# Altium schematic sheet 07. MT7688AN RF Front End.SchDoc
size A3; DocumentNumber: 7; SheetNumber: 7; SheetTotal: 12
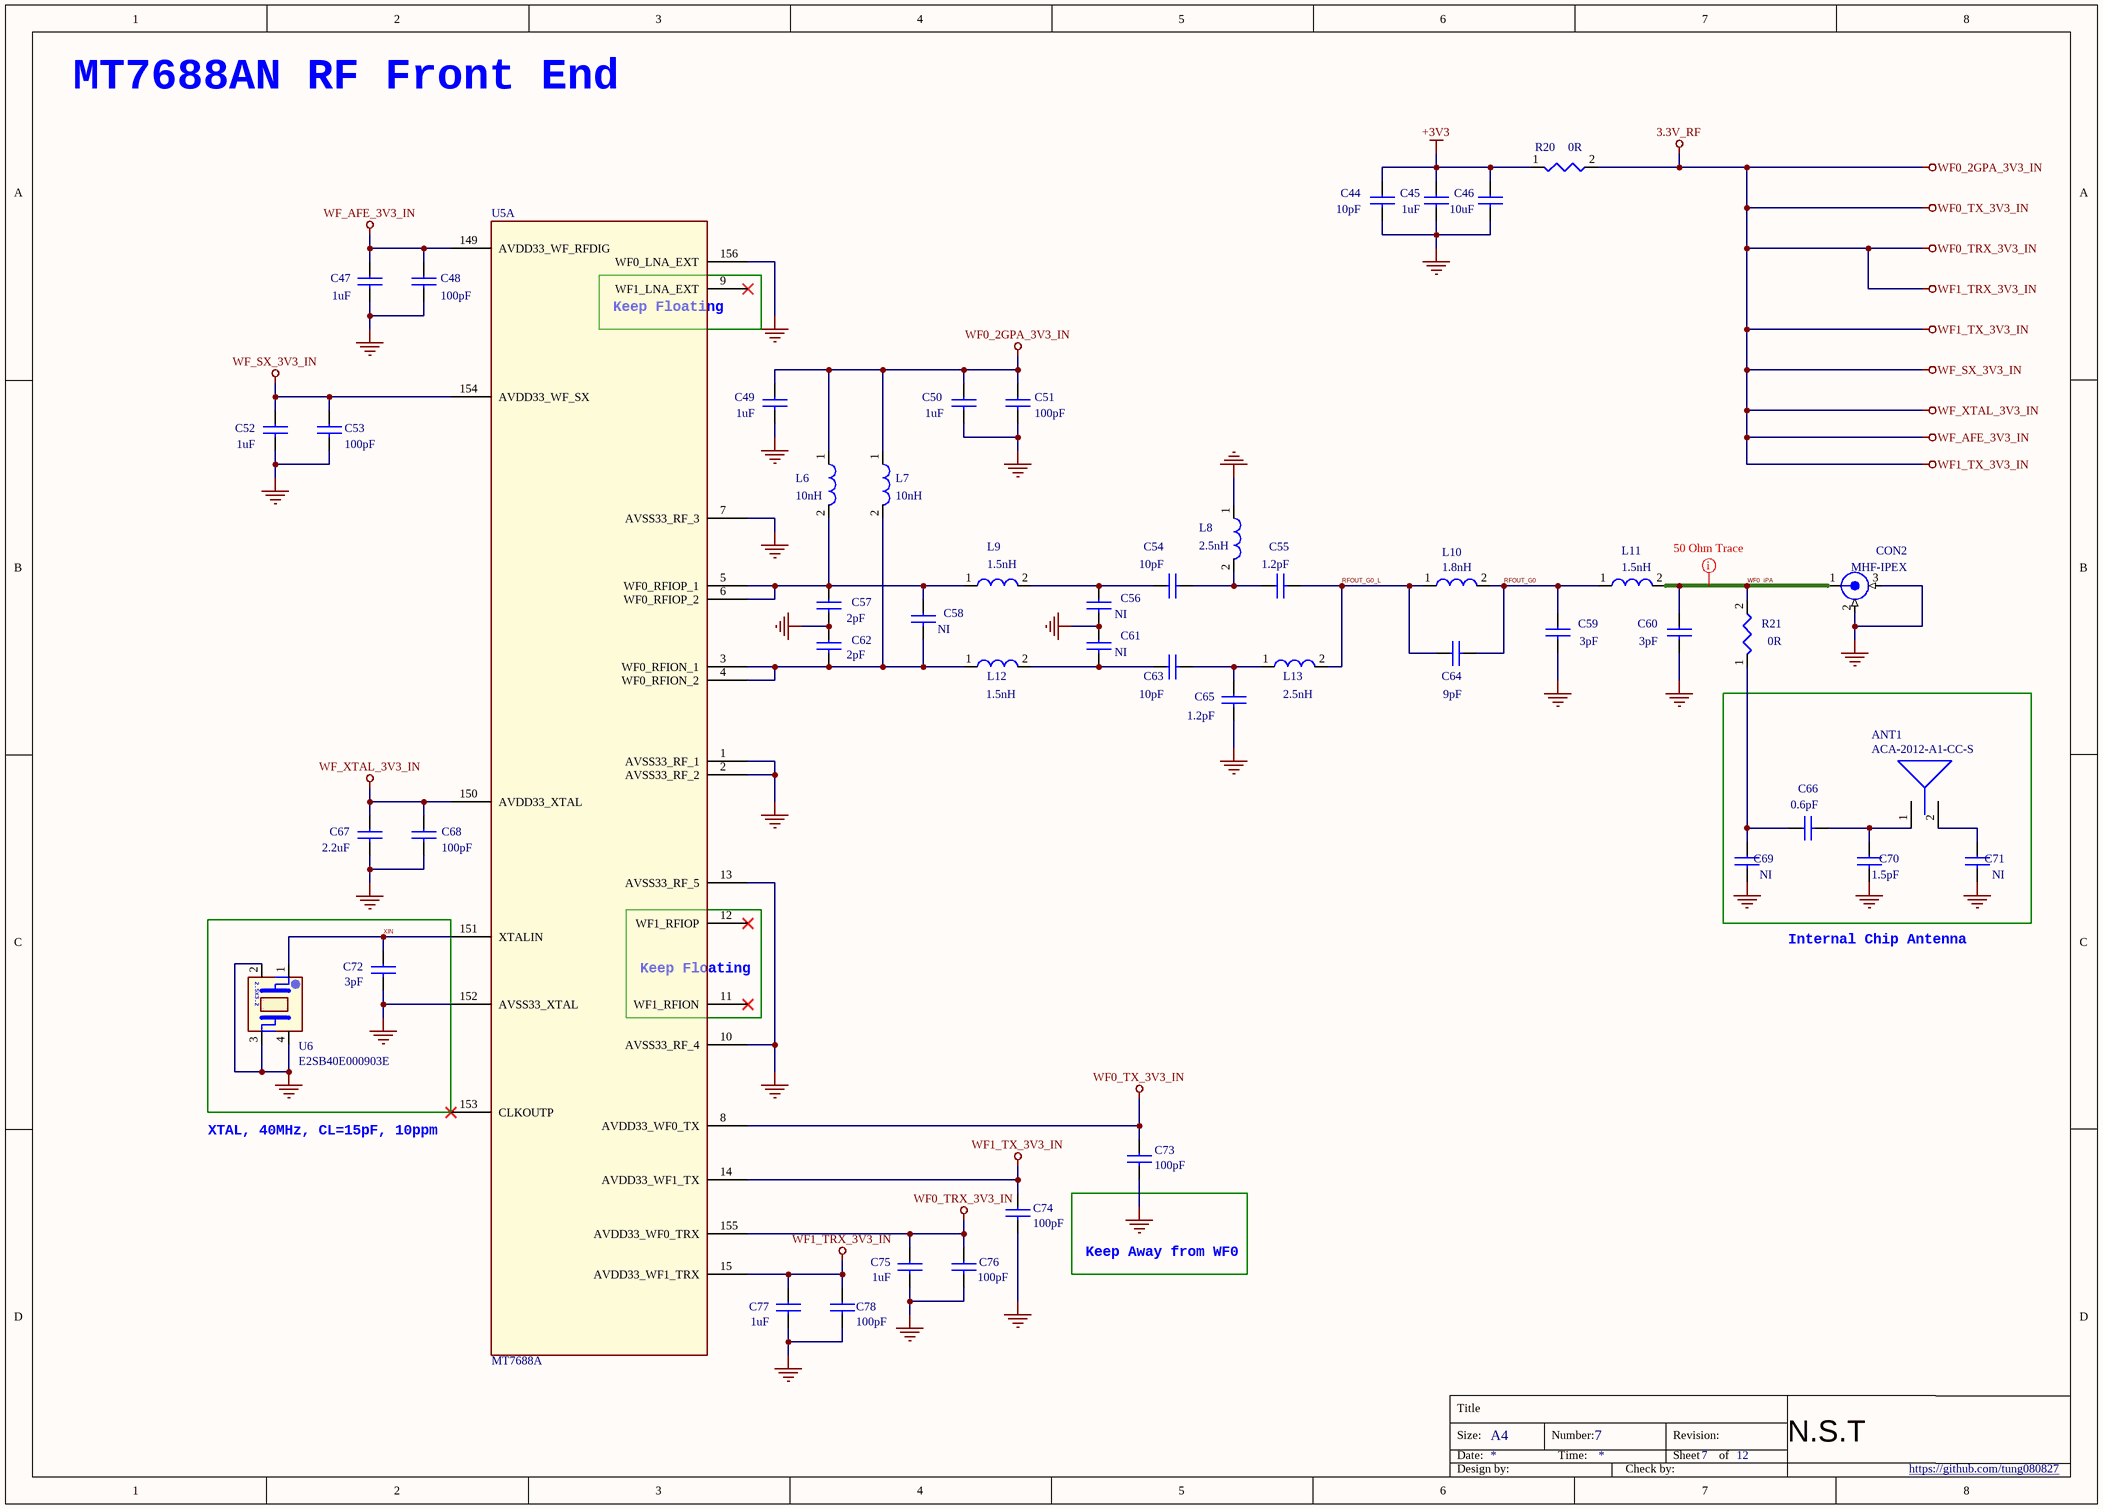
[diagram p0: 07. MT7688AN RF Front End.SchDoc]

## Parts
ANT1  ACA-2012-A1-CC-S  [ACA-2012A]
C44  10pF  [CAPC1005X60X30NL05T10]
C45  1uF  [CAPC1608X90X35NL10T15]
C46  10uF  [CAPC1608X90X35NL10T15]
C47  1uF  [CAPC1608X90X35NL10T15]
C48  100pF  [CAPC1005X60X30NL05T10]
C49  1uF  [CAPC1005X60X30NL05T10]
C50  1uF  [CAPC1005X60X30NL05T10]
C51  100pF  [CAPC1005X60X30NL05T10]
C52  1uF  [CAPC1608X90X35NL10T15]
C53  100pF  [CAPC1005X60X30NL05T10]
C54  10pF  [CAPC1005X60X30NL05T10]
C55  1.2pF  [CAPC1005X60X30NL05T10]
C56  NI  [CAPC1005X60X30NL05T10]
C57  2pF  [CAPC1005X60X30NL05T10]
C58  NI  [CAPC1005X60X30NL05T10]
C59  3pF  [CAPC1005X60X30NL05T10]
C60  3pF  [CAPC1005X60X30NL05T10]
C61  NI  [CAPC1005X60X30NL05T10]
C62  2pF  [CAPC1005X60X30NL05T10]
C63  10pF  [CAPC1005X60X30NL05T10]
C64  9pF  [CAPC1005X60X30NL05T10]
C65  1.2pF  [CAPC1005X60X30NL05T10]
C66  0.6pF  [CAPC1005X60X30NL05T10]
C67  2.2uF  [CAPC1608X90X35NL10T15]
C68  100pF  [CAPC1005X60X30NL05T10]
C69  NI  [CAPC1005X60X30NL05T10]
C70  1.5pF  [CAPC1005X60X30NL05T10]
C71  NI  [CAPC1005X60X30NL05T10]
C72  3pF  [CAPC1005X60X30NL05T10]
C73  100pF  [CAPC1005X60X30NL05T10]
C74  100pF  [CAPC1005X60X30NL05T10]
C75  1uF  [CAPC1608X90X35NL10T15]
C76  100pF  [CAPC1005X60X30NL05T10]
C77  1uF  [CAPC1608X90X35NL10T15]
C78  100pF  [CAPC1005X60X30NL05T10]
CON2  MHF-IPEX  [I-PEX CON]
L6  10nH  [CAPC1005X60X30NL05T10]
L7  10nH  [CAPC1005X60X30NL05T10]
L8  2.5nH  [CAPC1005X60X30NL05T10]
L9  1.5nH  [CAPC1005X60X30NL05T10]
L10  1.8nH  [CAPC1005X60X30NL05T10]
L11  1.5nH  [CAPC1005X60X30NL05T10]
L12  1.5nH  [CAPC1005X60X30NL05T10]
L13  2.5nH  [CAPC1005X60X30NL05T10]
R20  0R  [RESC1609X50X30LL10T20]
R21  0R  [RESC1005X40X25NL05T05]
U5  MT7688A  [MT7628AN12X12]  (part A of 6)
U6  E2SB40E000903E  [XTAL 2520]

## Nets
3.3V_RF: C47.1 C48.1 C49.1 C50.1 C51.1 C52.1 C53.1 C67.1 C68.1 C73.1 C74.1 C75.1 C76.1 C77.1 C78.1 L6.1 L7.1 R20.2 U5.8(AVDD33_WF0_TX) U5.14(AVDD33_WF1_TX) U5.15(AVDD33_WF1_TRX) U5.149(AVDD33_WF_RFDIG) U5.150(AVDD33_XTAL) U5.154(AVDD33_WF_SX) U5.155(AVDD33_WF0_TRX)  [also labelled WF0_2GPA_3V3_IN, WF0_TRX_3V3_IN, WF0_TX_3V3_IN, WF1_TRX_3V3_IN, WF1_TX_3V3_IN, WF_AFE_3V3_IN, WF_SX_3V3_IN, WF_XTAL_3V3_IN]
+3V3: C44.1 C45.1 C46.1 R20.1
GND: C44.2 C45.2 C46.2 C47.2 C48.2 C49.2 C50.2 C51.2 C52.2 C53.2 C56.2 C57.2 C59.2 C60.2 C61.1 C62.1 C65.2 C67.2 C68.2 C69.2 C70.2 C71.2 C72.2 C73.2 C74.2 C75.2 C76.2 C77.2 C78.2 CON2.2 CON2.3(GNDA) L8.1 U5.1(AVSS33_RF_1) U5.2(AVSS33_RF_2) U5.7(AVSS33_RF_3) U5.10(AVSS33_RF_4) U5.13(AVSS33_RF_5) U5.152(AVSS33_XTAL) U5.156(WF0_LNA_EXT) U6.2(NC) U6.3(X2) U6.4(NC)
RFOUT_G0: C59.1 C64.2 L10.2 L11.1
RFOUT_G0_L: C55.2 C64.1 L10.1 L13.2
WF0_iPA: C60.1 CON2.1 L11.2 R21.2
XIN: C72.1 U5.151(XTALIN) U6.1(X1)
NetANT1_1: ANT1.1(IN) C66.2 C70.1
NetANT1_2: ANT1.2(OUT) C71.1
NetC54_1: C54.1 C56.1 L9.2
NetC54_2: C54.2 C55.1 L8.2
NetC57_1: C57.1 C58.1 L6.2 L9.1 U5.5(WF0_RFIOP_1) U5.6(WF0_RFIOP_2)
NetC58_2: C58.2 C62.2 L7.2 L12.1 U5.3(WF0_RFION_1) U5.4(WF0_RFION_2)
NetC61_2: C61.2 C63.1 L12.2
NetC63_2: C63.2 C65.1 L13.1
NetC66_1: C66.1 C69.1 R21.1

Not connected (* = marked no-connect by the designer): U5 9(WF1_LNA_EXT)* 11(WF1_RFION)* 12(WF1_RFIOP)* 153(CLKOUTP)*

## Layout directives
mark named 50 Ohm Trace: WF0_iPA

## Notes on the sheet
- MT7688AN RF Front End
- (near U5) Keep Floating
- Internal Chip Antenna
- XTAL, 40MHz, CL=15pF, 10ppm
- Keep Away from WF0
- Title
- Size:
- Date:
- A4
- Number:
- Time:
- Revision:
- Sheet
- of
- N.S.T
- Design by:
- Check by:
- https://github.com/tung080827
- (in symbol XTAL_3.2x2.5) 2.5x3.2

## Library data of the parts
ANT1 = Antenna_2012
C44-C78 = CAP NP
CON2 = SMA/UFLR
L6-L8 L10 L13 = L/0402
L9 L11 L12 = L/0402: LQP03TN1N5B02D
R20 R21 = RES/0402_3
U5 = MT7620N-n_26
U6 = XTAL_3.2x2.5: XTAL, 40MHz, CL=15pF, 10ppm, -30~+85C